# EasyEDA schematic Sheet_1.json
TITLE: Sheet_1; REV: 1.0; Date: 2025-05-11; Sheet: 1/1; Drawn By: ahmadputracahyo; Company: Your Company
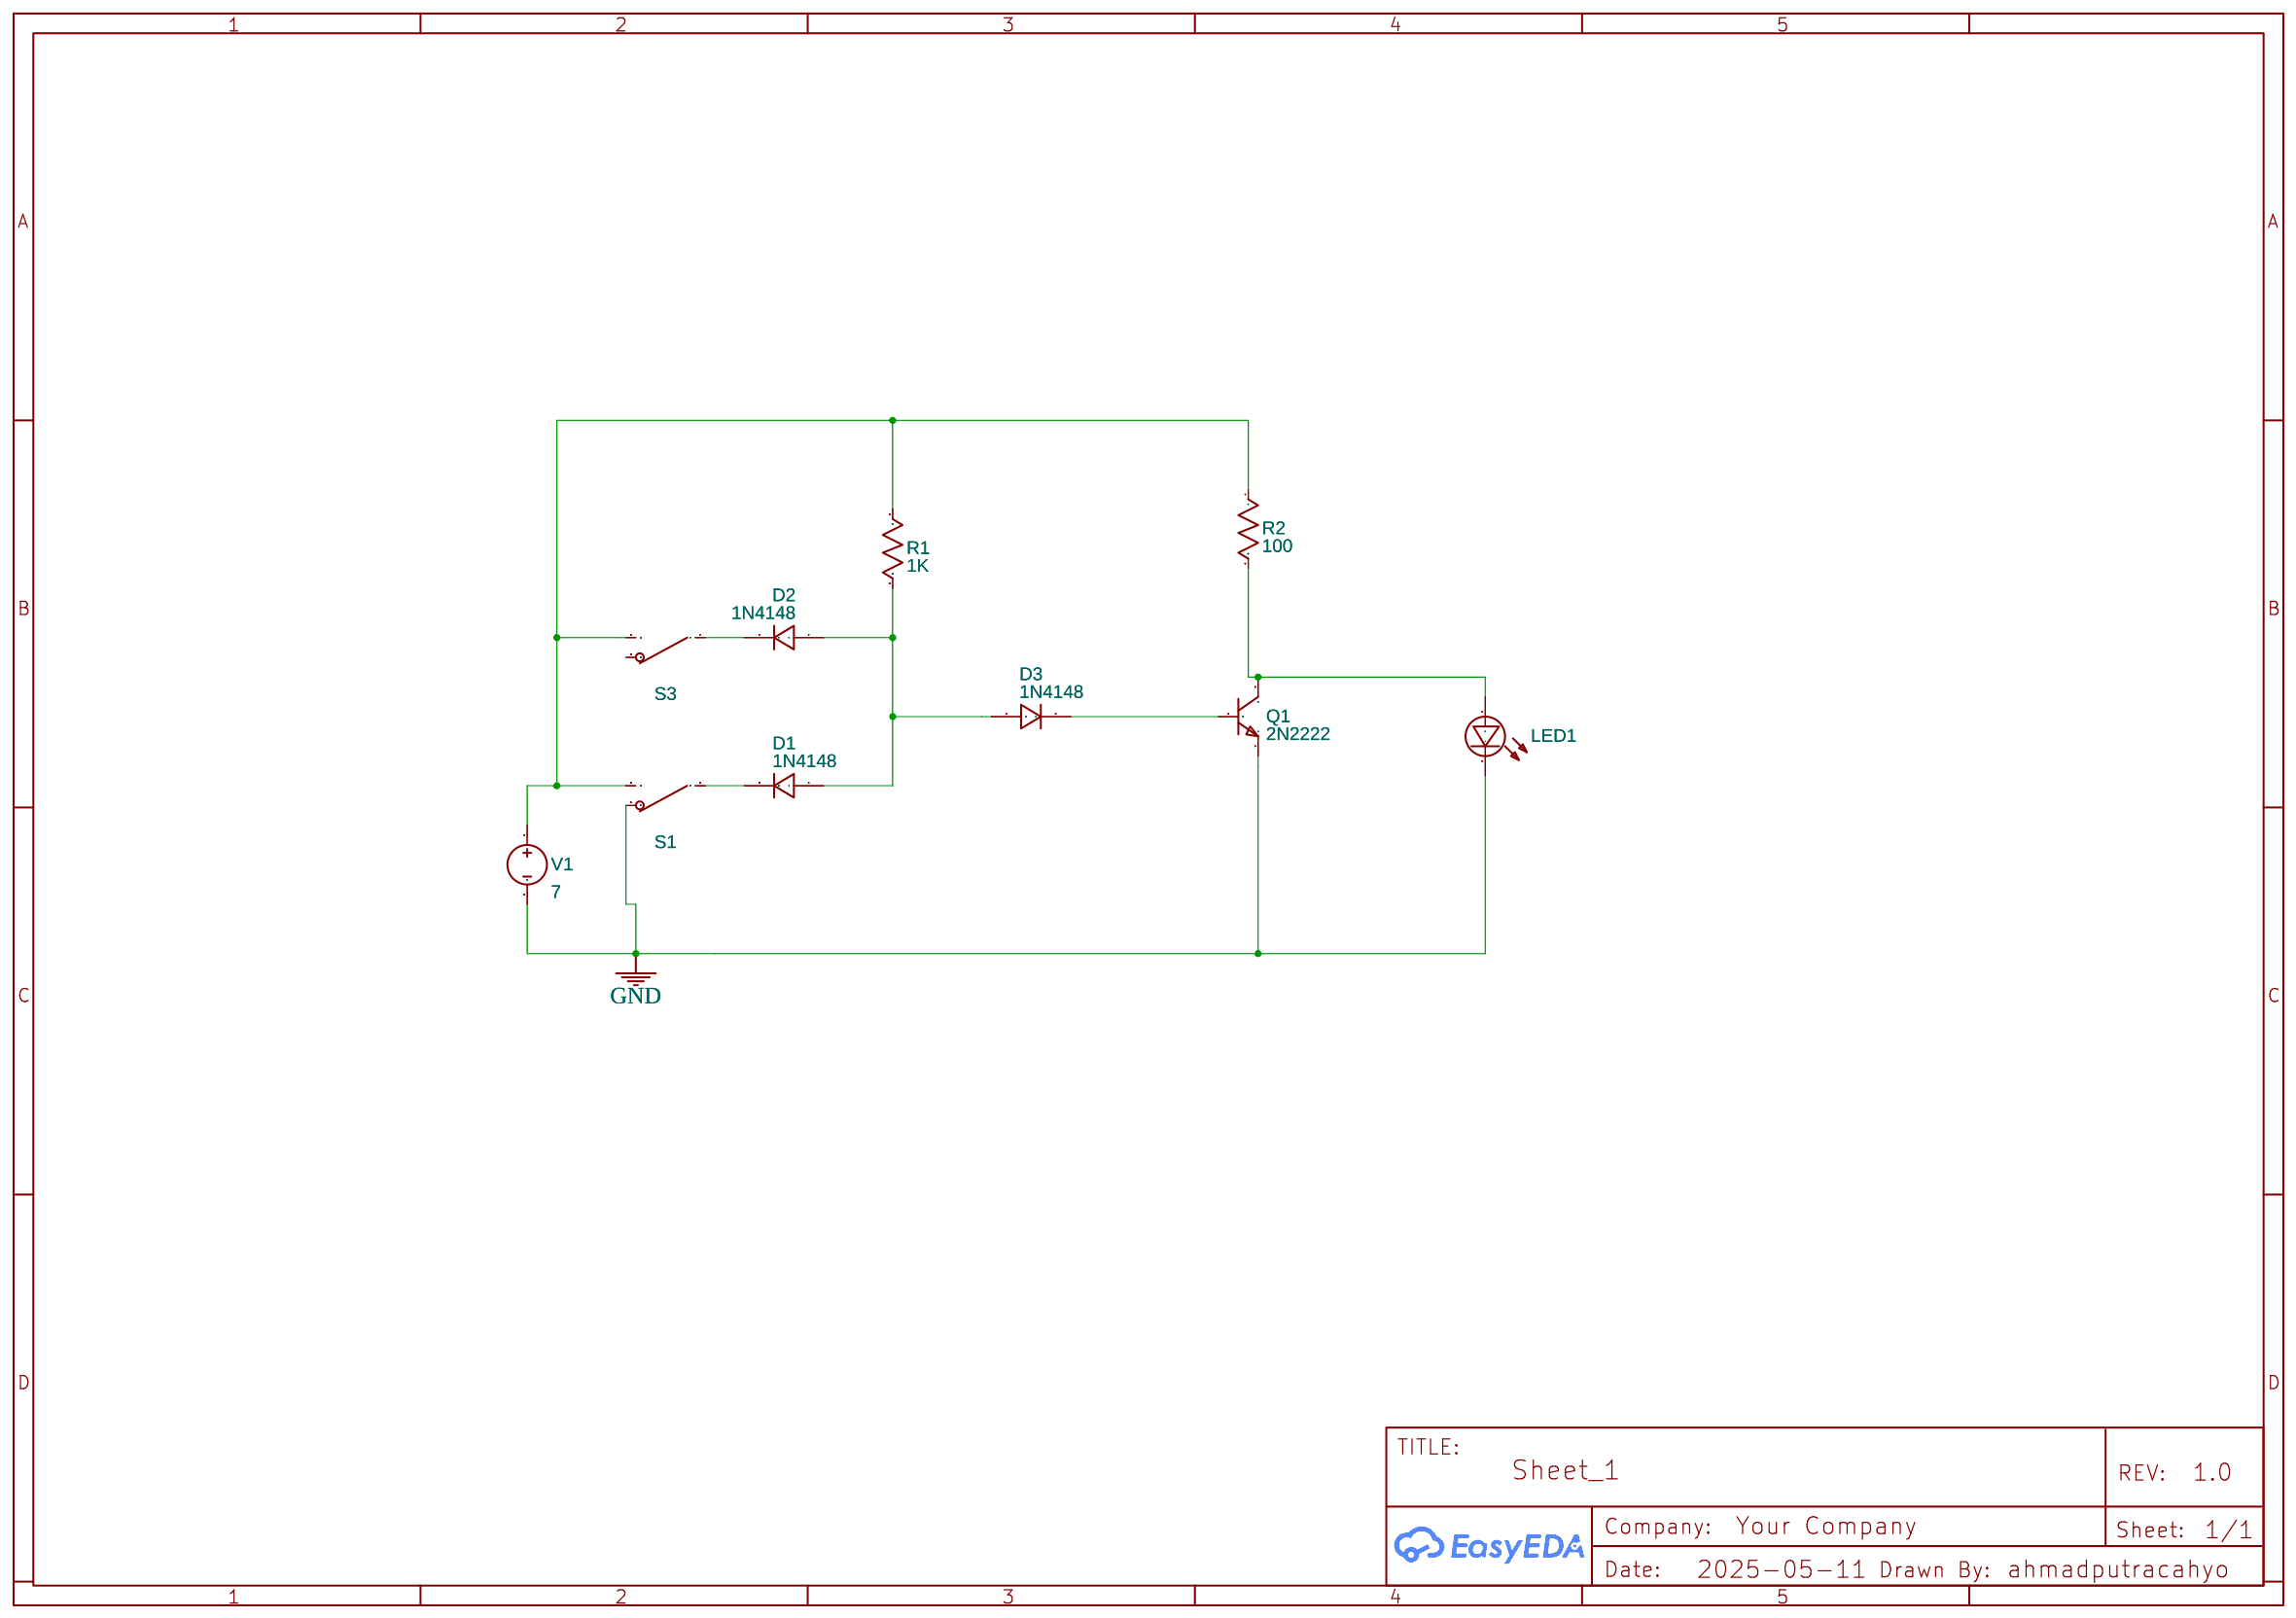
[diagram p0: schematic sheet]

## Parts
D1  1N4148  [DO-35]
D2  1N4148  [DO-35]
D3  1N4148  [DO-35]
LED1  LED
Q1  2N2222
R1  1K  [AXIAL-0.3]
R2  100  [AXIAL-0.3]
S1  SPDT_Open
S3  SPDT_Open
V1  7  [HDR1X2]

## Library data of the parts
D1-D3 = 1N4148: Contributor: EasyEDA
LED1 = LED: catid: 20; Contributor: 仿真库绘制; Color: Red; NameDisplay: 0
Q1 = 2N2222: Contributor: EasyEDA
R1 R2 = Resistor_US: Resistance: 1k; Contributor: EasyEDA; Supplier: YUJING
S1 S3 = SPDT: catid: 20; Contributor: EasyEDA; State: Open; NameDisplay: 0
V1 = VDC: Contributor: EasyEDA; sim: true

## Nets
GND: LED1.2(-) Q1.2(E) S1.2 V1.2
Net-(D1-1): D1.1(A) D2.1(A) D3.1(A) R1.2
Net-(D1-2): D1.2(K) S1.1
Net-(D2-2): D2.2(K) S3.1
Net-(D3-2): D3.2(K) Q1.1(B)
Net-(LED1-1): LED1.1(+) Q1.3(C) R2.2
Net-(R1-1): R1.1 R2.1 S1.3 S3.3 V1.1

Not connected (* = marked no-connect by the designer): S3 2
